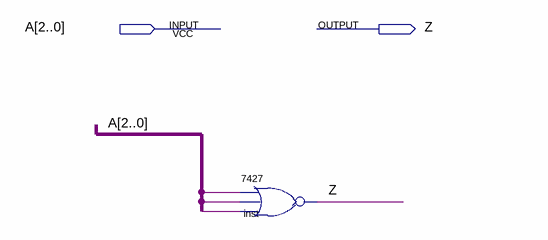
[diagram p0: schematic sheet]
// Quartus schematic nor_3in.bdf as structural Verilog: 1 symbols, 2 pins
module nor_3in (
  input  [2:0] A,
  output Z
);

  wire undriven, undriven_2, undriven_3;

  \7427  inst (.\4 (undriven_3), .\3 (undriven_2), .\2 (undriven), .\1 (Z));
endmodule
